# Altium schematic sheet 5V and 3V3 Outputs.SchDoc
size A4
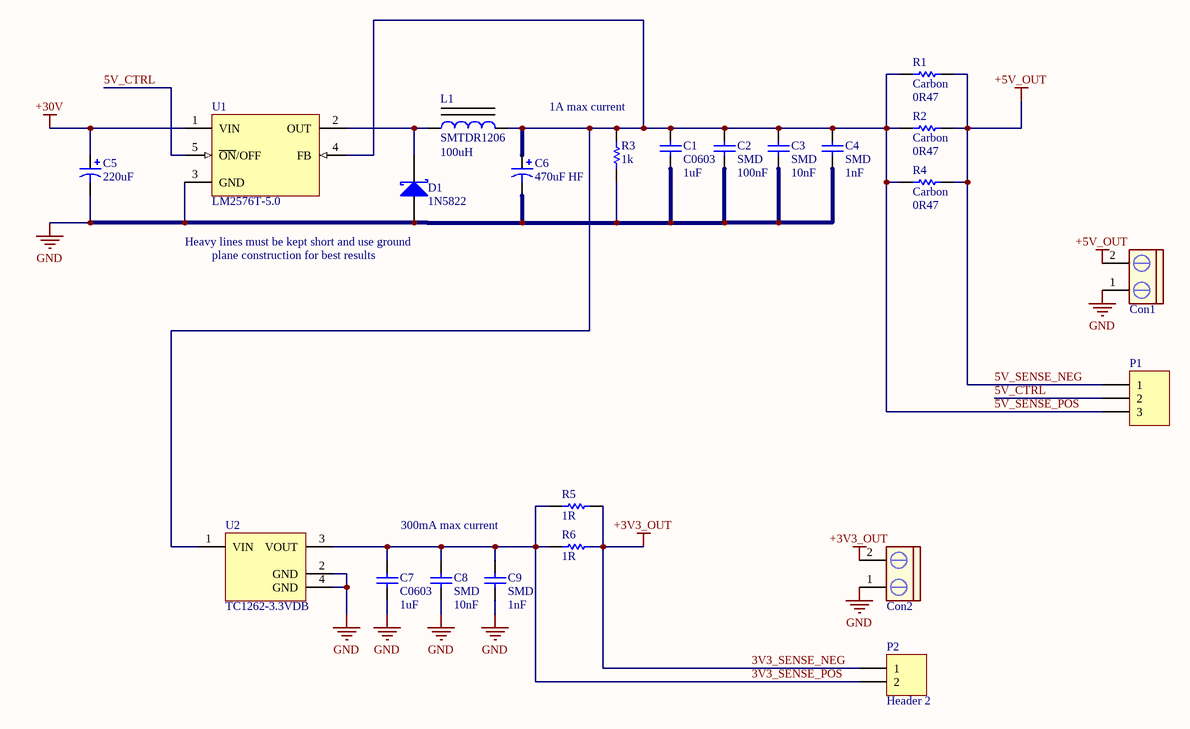
[diagram p0: 5V and 3V3 Outputs.SchDoc]

## Parts
C1  C0603  value 1uF  [0603]
C2  SMD  value 100nF  [1206]
C3  SMD  value 10nF  [1206]
C4  SMD  value 1nF  [1206]
C5  220uF  [CAPPR5-10X16]
C6  470uF HF  [CAPPR5-10X20]
C7  C0603  value 1uF  [0603]
C8  SMD  value 10nF  [1206]
C9  SMD  value 1nF  [1206]
Con1  Salida Buck  [My_CN2]  (value not drawn)
Con2  Salida Buck  [My_CN2]  (value not drawn)
D1  1N5822  [Vertical DO-201AD]
L1  SMTDR1206  value 100uH  [SMTDR1206 Inductor]
P1  Header 3  [My_1X03]  (value not drawn)
P2  Header 2  [HDR1X2]
R1  Carbon  value 0R47  [AXIAL-0.3]
R2  Carbon  value 0R47  [AXIAL-0.3]
R3  value 1k  [8RB-1206]  (hidden comment: SMD)
R4  Carbon  value 0R47  [AXIAL-0.3]
R5  value 1R  [8RB-1206]  (hidden comment: SMD)
R6  value 1R  [8RB-1206]  (hidden comment: SMD)
U1  LM2576T-5.0  [T05A]
U2  TC1262-3.3VDB  [SOT-223-DB3_N]

## Nets
3V3_SENSE_NEG: Con2.2 P2.1 R5.2 R6.2  [also labelled +3V3_OUT]
5V_SENSE_NEG: Con1.2 P1.1 R1.2 R2.2 R4.2  [also labelled +5V_OUT]
+30V: C5.1 U1.1(VIN)
GND: C1.1 C2.1 C3.1 C4.1 C5.2 C6.2 C7.1 C8.1 C9.1 Con1.1 Con2.1 D1.1(A) R3.1 U1.3(GND) U2.2(GND) U2.4(GND)
3V3_SENSE_POS: C7.2 C8.2 C9.2 P2.2 R5.1 R6.1 U2.3(VOUT)
5V_CTRL: P1.2 U1.5(~{ON}/OFF)
5V_SENSE_POS: C1.2 C2.2 C3.2 C4.2 C6.1 L1.2 P1.3 R1.1 R2.1 R3.2 R4.1 U1.4(FB) U2.1(VIN)
NetD1_2: D1.2(K) L1.1 U1.2(OUT)

## Notes on the sheet
- (near R3) 1A max current
- Heavy lines must be kept short and use ground
- plane construction for best results
- 300mA max current

## Library data of the parts
C1 C7 = C0603: C1608X7R1C105K X7R; Note: Footprint corresponds to dimensions for bulk cassette packaging. This case size has tightened tolerances.; Published: 17-Jul-2002; LatestRevisionDate: 19-Mar-2004; LatestRevisionNote: Silkscreen size reduced.; DatasheetDocument: Mar-2001; PackageDocument: Mar-2001; PackageReference: 0603; Publisher: Altium Limited; Code_JEITA: 0603; Code_IPC: 1608 [0603]; ComponentLink1Description: Manufacturer Link; ComponentLink1URL: http://www.kemet.com/; ComponentLink2Description: Datasheet; ComponentLink2URL: http://www.kemet.com/kemet/web/homepage/kechome.nsf/vapubfilesname/F3102TA.pdf/$file/F3102TA.pdf
C2-C4 C8 C9 = C1206: Ceramic Chip Capacitor - Standard; Published: 17-Jul-2002; LatestRevisionDate: 19-Mar-2004; LatestRevisionNote: Silkscreen size reduced.; DatasheetDocument: Mar-2001; PackageDocument: Mar-2001; PackageReference: 1206; Publisher: Altium Limited; Code_JEITA: 1206; Code_IPC: 3216 [1206]; ComponentLink1Description: Manufacturer Link; ComponentLink1URL: http://www.kemet.com/; ComponentLink2Description: Datasheet; ComponentLink2URL: http://www.kemet.com/kemet/web/homepage/kechome.nsf/vapubfilesname/F3102TA.pdf/$file/F3102TA.pdf
C5 = EKA00DD322J00: Aluminum Electrolytic Capacitor, Radial Style with Long Leads: 220uF, 63V; Note: Refer to Manufacturer's Data Sheets for other lead formations; DrillSize: Nominal, Rounded To The Nearest 0.1mm; Published: 19-Mar-2004; DatasheetDocument: 20-Feb-2001; PackageReference: CAPPR5-10X16; Publisher: Altium Limited; ComponentLink1Description: Manufacturer Link; ComponentLink1URL: http://www.vishay.com/; ComponentLink2Description: Datasheet; ComponentLink2URL: http://www.vishay.com/docs/25014/eka.pdf; Value: 220uF
C6 = EKC00DE347E00: Aluminum Electrolytic Capacitor, Radial Style with Long Leads: 470uF, 25V; Note: Refer to Manufacturer's Data Sheets for other lead formations; DrillSize: Nominal, Rounded To The Nearest 0.1mm; Published: 19-Mar-2004; DatasheetDocument: 12-Jan-2000; PackageReference: CAPPR5-10X20; Publisher: Altium Limited; ComponentLink1Description: Manufacturer Link; ComponentLink1URL: http://www.vishay.com/; ComponentLink2Description: Datasheet; ComponentLink2URL: http://www.vishay.com/docs/25009/ekc.pdf; Value: 470uF
Con1 Con2 = CON2 pin blue: Connector blue screw
D1 = Generic Schottky Diode
L1 = 100UHY SMD 18.54X7.11MM 20% 3A 0.19E SMTDR1206-101M
P1 = Header 3: Header, 3-Pin; LatestRevisionDate: 17-Jul-2002; LatestRevisionNote: Re-released for DXP Platform.; Publisher: Altium Limited
P2 = Header 2: Header, 2-Pin; LatestRevisionDate: 17-Jul-2002; LatestRevisionNote: Re-released for DXP Platform.; Publisher: Altium Limited
R1 R2 R4 = Res1: Resistor; Published: 8-Jun-2000; LatestRevisionDate: 17-Jul-2002; LatestRevisionNote: Re-released for DXP Platform.; PackageReference: AXIAL-0.3; Publisher: Altium Limited; PackageDescription: Axial Device, Thru-Hole; 2 Leads; 0.3 in Pin Spacing
R3 R5 R6 = ERJ8BQ: Low Ohmic Value Thick Film Chip Resistor, 0.22 Ohm to 9.1 Ohm Range, 1%, 2% and 5% Tolerance, 1206 Size, 0.33 W; Published: 17-Dec-2003; LatestRevisionDate: 19-Mar-2004; LatestRevisionNote: Silkscreen size reduced.; PackageDocument: Mar-2003; PackageReference: 8RB-1206; Publisher: Altium Limited; Code_IPC: 3216 [1206]; ComponentLink1Description: Manufacturer Link; ComponentLink1URL: http://www.panasonic.com/industrial/components/resistive_products.htm; ComponentLink2Description: Datasheet; ComponentLink2URL: http://www.panasonic.com/industrial/components/pdf/AOA0000CE3.pdf
U1 = LM2576T-5.0: SIMPLE SWITCHER® 3A Step-Down Voltage Regulator, 5-pin TO-220; Manufacturer: National Semiconductor; PackageTopMarking: NSUZXYTTE#*LM2576T*-5.0 P+; PowerWise: N; Published: 4-Dec-2008; DatasheetVersion: Aug-2004; PackageVersion: revJ, Jan-1992; PackageReference: T05A; Publisher: Altium Limited; PackageDescription: TO-220, Molded, 5 Lead, Straight; Supplier 1: Farnell; Supplier Part Number 1: 9488138; Supplier 2: Farnell; Supplier Part Number 2: 1523840; PartNumber: LM2576T-5.0; RoHS: N; PinCount: 5; CompType: Switcher; Code_JEDEC: TO-220-AB; ComponentLink1Description: LM2576 Datasheet; ComponentLink1URL: http://www.national.com/ds/LM/LM2576.pdf; ComponentLink2Description: LM2576 Web Page; ComponentLink2URL: http://www.national.com/pf/LM/LM2576.html; ComponentLink3Description: T05A Package Page; ComponentLink3URL: http://www.national.com/packaging/folders/t05a.html
U2 = TC1262-3.3VDB: 500mA Fixed Output CMOS LDO, 3-Pin SOT-223, Extended Temperature; Published: 29-Jan-2009; DatasheetVersion: revB, 2002; PackageVersion: revBB, Aug-2009; PackageReference: SOT-223-DB3; Publisher: Altium Limited; PackageDescription: 3-Lead Plastic Small Outline Transistor (DB) [SOT-223]; Supplier 1: Digi-Key; Supplier Part Number 1: TC1262-3.3VDB-ND; ComponentLink1Description: Datasheet; ComponentLink1URL: http://ww1.microchip.com/downloads/en/DeviceDoc/21373b.pdf; ComponentLink2Description: Packaging Specification; ComponentLink2URL: http://www.microchip.com/stellent/groups/techpub_sg/documents/packagingspec/en012702.pdf; ComponentLink3Description: Microchip.com Home; ComponentLink3URL: http://www.microchip.com/